# EAGLE design Orientation bracelet (EAGLE 7.7.0)
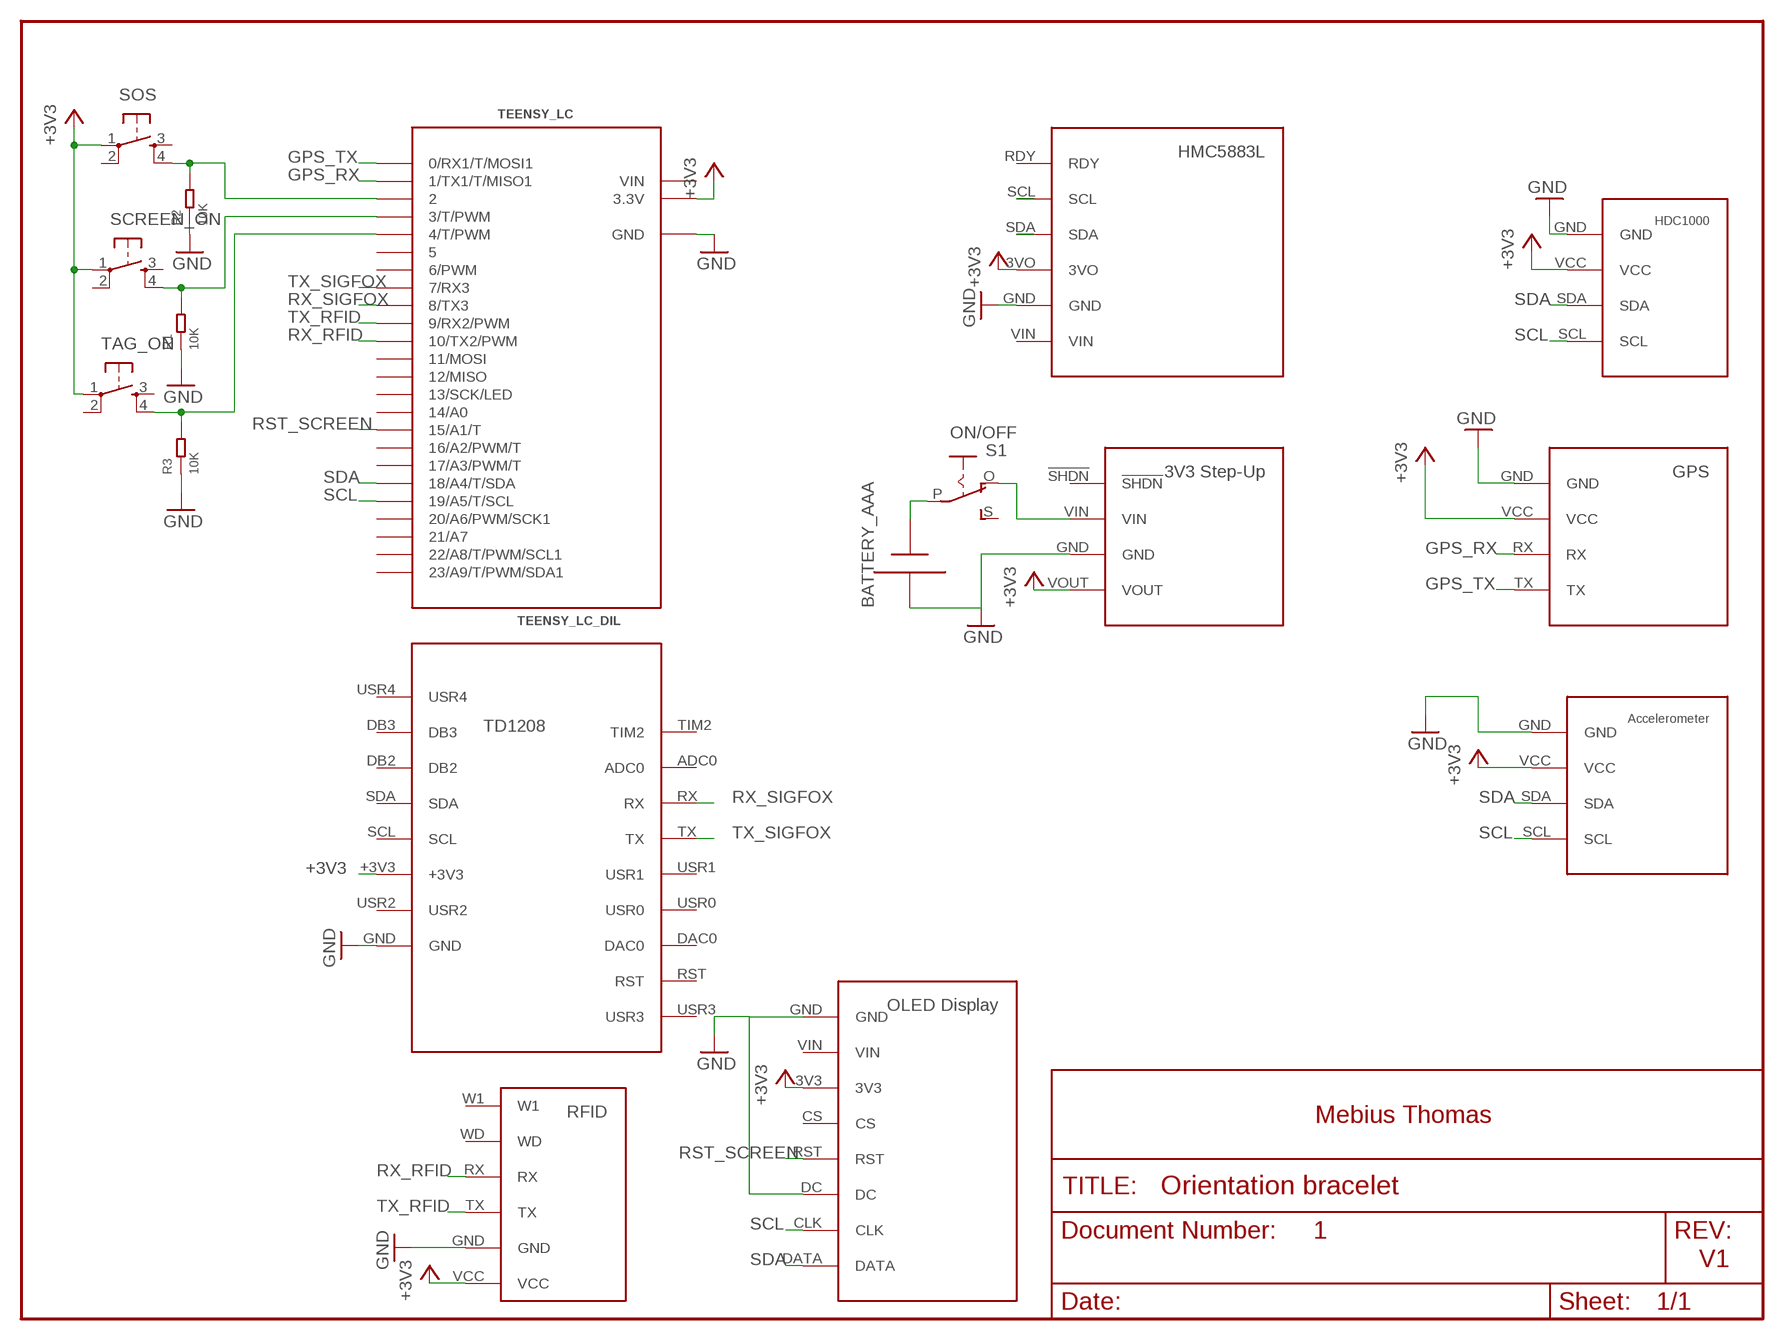
[diagram p0: schematic, sheet 1]

## Parts
BATTERY_AAA  AAA  [12BH412]
ON/OFF  S1  EG1218S  [EG1218]
R1  10K  DIP-RES-22K-5%-1/4W(PR-D2.3XL6.5MM)  [PR-D2.3XL6.5MM]
R2  10K  DIP-RES-22K-5%-1/4W(PR-D2.3XL6.5MM)  [PR-D2.3XL6.5MM]
R3  10K  DIP-RES-22K-5%-1/4W(PR-D2.3XL6.5MM)  [PR-D2.3XL6.5MM]
SCREEN_ON  TAC_SWITCHPTH  [TACTILE-PTH]
SOS  TAC_SWITCHPTH  [TACTILE-PTH]
TAG_ON  TAC_SWITCHPTH  [TACTILE-PTH]
TEENSY_LC  TEENSY_LC_DIL  [TEENSY_3.0-3.2&LC_DIL]
U$1  OLED_DISPLAY  [OLED_DISPLAY]
U$2  RFID"  [RFID]
U$3  3V3_STEP-UP  [3V3_STEP-UP]
U$4  ACCELEROMETER  [ACCELEROMETER]
U$5  HDC1000  [HDC1000]
U$6  GPS  [GPS]
U$7  HMC5883L  [HMC5883L]
U$8  TD1208  [TD1208]

## Nets
+3V3: SCREEN_ON.1 SOS.1 TAG_ON.1 TEENSY_LC.3.3V U$1.3V3 U$2.VCC U$3.VOUT U$4.VCC U$5.VCC U$6.VCC U$7.3VO U$8.+3V3
GND: BATTERY_AAA.- R1.1 R2.1 R3.1 TEENSY_LC.AGND(GND) TEENSY_LC.GND U$1.DC U$1.GND U$2.GND U$3.GND U$4.GND U$5.GND U$6.GND U$7.GND U$8.GND
GPS_RX: TEENSY_LC.1(1/TX1/T/MISO1) U$6.RX
GPS_TX: TEENSY_LC.0(0/RX1/T/MOSI1) U$6.TX
N$3: R2.2 SOS.4 TEENSY_LC.2
N$4: R1.2 SCREEN_ON.4 TEENSY_LC.3(3/T/PWM)
N$5: R3.2 TAG_ON.4 TEENSY_LC.4(4/T/PWM)
N$7: BATTERY_AAA.+ ON/OFF.P
N$8: ON/OFF.O U$3.VIN
RST_SCREEN: TEENSY_LC.15/A1(15/A1/T) U$1.RST
RX_RFID: TEENSY_LC.10(10/TX2/PWM) U$2.RX
RX_SIGFOX: TEENSY_LC.8(8/TX3) U$8.RX
SCL: TEENSY_LC.19/A5(19/A5/T/SCL) U$1.CLK U$4.SCL U$5.SCL U$7.SCL
SDA: TEENSY_LC.18/A4(18/A4/T/SDA) U$1.DATA U$4.SDA U$5.SDA U$7.SDA
TX_RFID: TEENSY_LC.9(9/RX2/PWM) U$2.TX
TX_SIGFOX: TEENSY_LC.7(7/RX3) U$8.TX
Unconnected: ON/OFF.S SCREEN_ON.2 SCREEN_ON.3 SOS.2 SOS.3 TAG_ON.2 TAG_ON.3 TEENSY_LC.5 TEENSY_LC.6(6/PWM) TEENSY_LC.11(11/MOSI) TEENSY_LC.12(12/MISO) TEENSY_LC.13(13/SCK/LED) TEENSY_LC.14/A0 TEENSY_LC.16/A2(16/A2/PWM/T) TEENSY_LC.17/A3(17/A3/PWM/T) TEENSY_LC.20/A6(20/A6/PWM/SCK1) TEENSY_LC.21/A7 TEENSY_LC.22/A8(22/A8/T/PWM/SCL1) TEENSY_LC.23/A9(23/A9/T/PWM/SDA1) U$1.CS U$1.VIN U$2.W1 U$2.WD U$3.!SHDN U$7.RDY U$7.VIN U$8.ADC0 U$8.DAC0 U$8.DB2 U$8.DB3 U$8.RST U$8.SCL U$8.SDA U$8.TIM2 U$8.USR0 U$8.USR1 U$8.USR2 U$8.USR3 U$8.USR4

## Notes on the sheet
- Mebius Thomas
- 1
- V1

## Power pins joined to a net without a drawn wire
VIN: TEENSY_LC.VIN

## Library data of the parts
BATTERY_AAA = adafruit:AAA: AAA PC pin holder Mouser part #12BH412 - but pretty much any 1x AAA battery holder should be the same http://www.ladyada.net/library/pcb/eaglelibrary.html
ON/OFF = adafruit:EG1218: SLIDING SWITCH 0.1" spacing through hole, vertical SPDT slide switch http://www.ladyada.net/library/pcb/eaglelibrary.html
R1-R3 = Seeed-OPL-Resistor:DIP-RES-22K-5%-1/4W(PR-D2.3XL6.5MM): 301020018; MPN: FHCFR-1/4W-223J; VALUE: 22K
SCREEN_ON SOS TAG_ON = JarduinoV5:TAC_SWITCH: Momentary Switch Button commonly used for reset or general input. Spark Fun Electronics SKU : COM-00097 SMT- SWCH-08247
TEENSY_LC = Teensy_3_and_LC_Series_Boards_v1.4:TEENSY_LC_DIL
U$1 = Mebius:OLED_DISPLAY: Ecran monochrome 128X64 ADA326
U$2 = Mebius:RFID: Module RFID 125 kHz
U$3 = Mebius:3V3_STEP-UP: Pololu 3.3V Step-Up Voltage Regulator U1V11F3
U$4 = Mebius:ACCELEROMETER: Accéléromètre 3 axes Grove
U$5 = Mebius:HDC1000: Grove Temperature&Humidity Sensor HDC1000
U$6 = Mebius:GPS: Module GPS Grove
U$7 = Mebius:HMC5883L: Triple-axis Magnetometer (Compass) Board - HMC5883L
U$8 = Mebius:TD1208

## Board
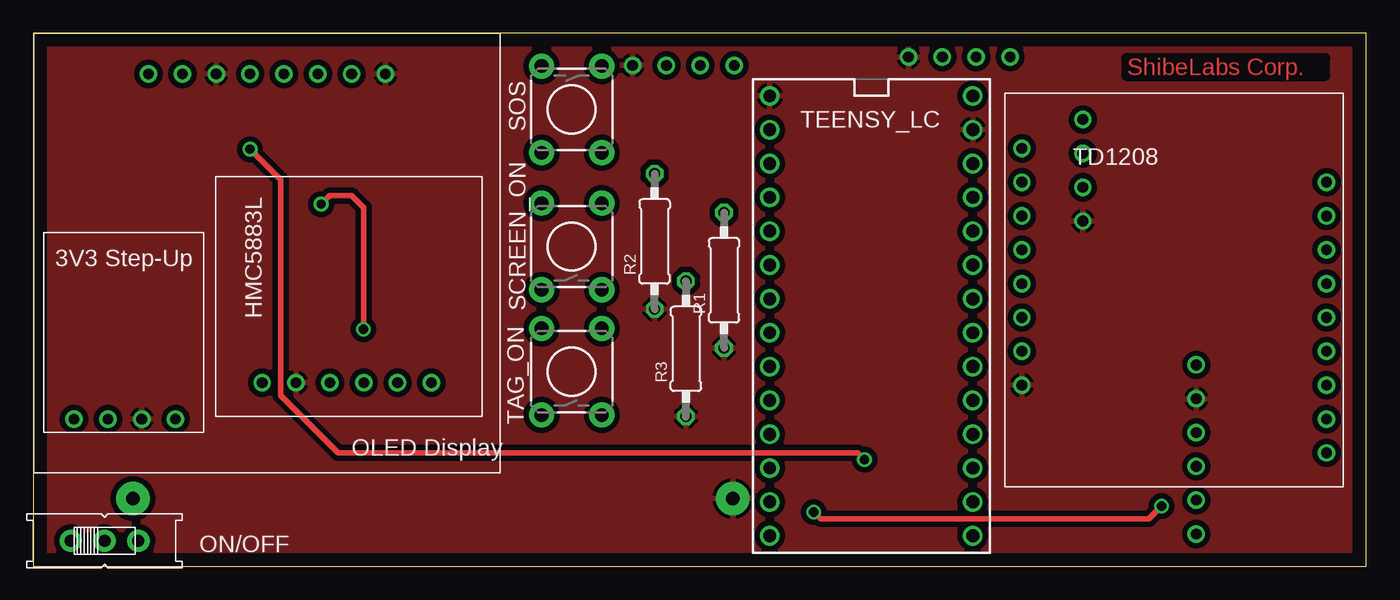
[diagram p1: board, top side]
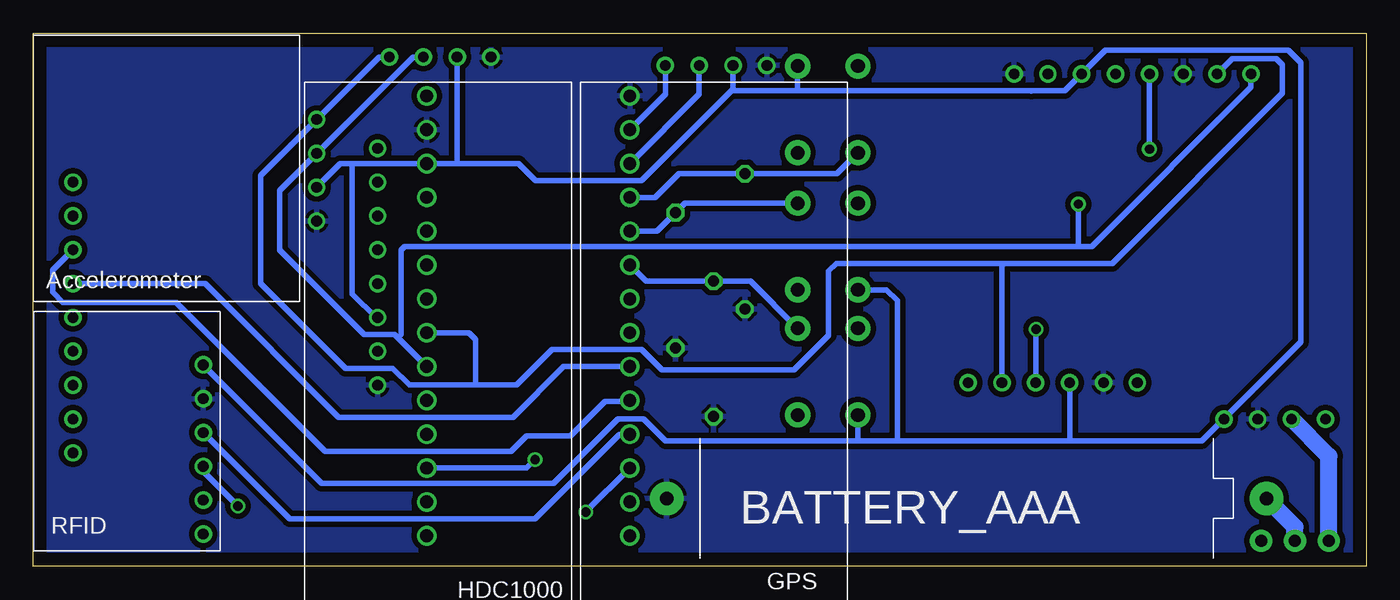
[diagram p2: board, bottom side, seen from below]

Size 100.01 x 40 mm. Coordinates in mm from the lower left corner, seen from the top.
Outline: 0.01,0 100.01,0 100,40 0,40 0.01,0
Copper layers (1*16): Top 0.035mm / dielectric 1.5mm / Bottom 0.035mm
Design rules "default *": minimum track width 10mil, minimum drill 24mil, track to track 16mil, track to pad 8mil, pad to pad 16mil, via to via 16mil, smd to smd 8mil, copper to edge 40mil, drill to drill 8mil, minimum pad ring 10mil, minimum via ring 8mil, stop-mask expansion 4mil, vias tented up to drill 0mil, thermal gap 10mil

### Footprints (pad centres in the part's own frame; a part is rotated, then mirrored left to right if it is on the bottom)
12BH412 = drill 1 pad 2.54: + 22.5,0; - -22.5,0
EG1218 = drill 0.9 pad 1.676: O -2.54,0; P 0,0; S 2.54,0
PR-D2.3XL6.5MM = drill 0.813 octagon: 1 -4.953,0; 2 5.207,0
TACTILE-PTH = drill 1.016 pad 1.88: 1 -3.251,2.261; 2 3.251,2.261; 3 -3.251,-2.261; 4 3.251,-2.261
TEENSY_3.0-3.2&LC_DIL = drill 0.965: 0 -7.62,13.97; 1 -7.62,11.43; 2 -7.62,8.89; 3 -7.62,6.35; 3.3V 7.62,11.43; 4 -7.62,3.81; 5 -7.62,1.27; 6 -7.62,-1.27; 7 -7.62,-3.81; 8 -7.62,-6.35; 9 -7.62,-8.89; 10 -7.62,-11.43; 11 -7.62,-13.97; 12 -7.62,-16.51; 13 7.62,-16.51; 14/A0 7.62,-13.97; 15/A1 7.62,-11.43; 16/A2 7.62,-8.89; 17/A3 7.62,-6.35; 18/A4 7.62,-3.81; 19/A5 7.62,-1.27; 20/A6 7.62,1.27; 21/A7 7.62,3.81; 22/A8 7.62,6.35; 23/A9 7.62,8.89; AGND 7.62,13.97; GND -7.62,16.51; VIN 7.62,16.51
OLED_DISPLAY = drill 0.8: 3V3 3.81,13.462; CLK -6.35,13.462; CS 1.27,13.462; DATA -8.89,13.462; DC -3.81,13.462; GND 8.89,13.462; RST -1.27,13.462; VIN 6.35,13.462
RFID = drill 0.8: GND -2.54,6.35; RX 2.54,6.35; TX 0,6.35; VCC -5.08,6.35; W1 7.62,6.35; WD 5.08,6.35
3V3_STEP-UP = drill 0.8: !SHDN 3.81,6.35; GND -1.27,6.35; VIN 1.27,6.35; VOUT -3.81,6.35
ACCELEROMETER = drill 0.8: GND 3.81,11.43; SCL -3.81,11.43; SDA -1.27,11.43; VCC 1.27,11.43
HDC1000 = drill 0.8: GND 5.08,21.59; SCL -2.54,21.59; SDA 0,21.59; VCC 2.54,21.59
GPS = drill 0.8: GND 6.35,12.7; RX 1.27,12.7; TX -1.27,12.7; VCC 3.81,12.7
HMC5883L = drill 0.8: 3VO 1.27,6.35; GND 3.81,6.35; RDY -6.35,6.35; SCL -3.81,6.35; SDA -1.27,6.35; VIN 6.35,6.35
TD1208 = drill 0.8: +3V3 -11.43,-1.27; ADC0 11.43,6.35; DAC0 11.43,-6.35; DB2 -11.43,6.35; DB3 -11.43,8.89; GND -11.43,-6.35; RST 11.43,-8.89; RX 11.43,3.81; SCL -11.43,1.27; SDA -11.43,3.81; TIM2 11.43,8.89; TX 11.43,1.27; USR0 11.43,-3.81; USR1 11.43,-1.27; USR2 -11.43,-3.81; USR3 11.43,-11.43; USR4 -11.43,11.43

### Placement (x,y rotation side)
BATTERY_AAA  29.98,5.08 0 bottom
ON/OFF  5.34,1.91 0 top
R1  51.82,21.34 90 top
R2  46.62,24.26 90 top
R3  48.97,16.19 90 top
SCREEN_ON  40.39,24 90 top
SOS  40.39,34.29 270 top
TAG_ON  40.39,14.61 90 top
TEENSY_LC  62.87,18.8 0 top
U$1  17.53,23.5 0 top
U$2  93.61,10.03 270 bottom
U$3  6.87,17.4 180 top
U$4  90.18,29.72 270 bottom
U$5  70.75,16.64 0 bottom
U$6  51.32,24.89 0 bottom
U$7  23.52,20.13 180 top
U$8  85.61,19.94 0 top

### Tracks (layer width: path | path; a pad name or v marks a point on that pad's centre or on a via)
+3V3
  Bottom 0.406: U$2.VCC 78.37,6.22 60.97,6.22 56.14,11.05 54.24,11.05 52.59,9.4 38.23,9.4 | 76.08,30.23 TEENSY_LC.3.3V 68.33,30.23 | 76.08,30.23 76.97,30.23 U$4.VCC | 47.63,35.69 54.36,28.96 62.34,28.96 63.61,30.23 68.33,30.23 | U$6.VCC 47.51,35.81 47.63,35.69 | 47.63,35.69 42.55,35.69 | 42.55,35.69 25.15,35.69 | 25.15,35.69 22.61,35.69 U$1.3V3 19.57,38.73 5.85,38.73 4.9,37.78 4.9,16.83 U$3.VOUT 12.33,9.4 22.17,9.4 | SOS.1 42.65,35.79 42.55,35.69 | 25.13,35.67 25.15,35.69 | U$5.VCC 68.21,30.35 68.33,30.23 | SCREEN_ON.1 36,20.75 35.19,19.94 35.19,9.4 | U$8.+3V3 74.3,18.67 76.08,20.45 76.08,30.23 | 38.23,9.4 35.19,9.4 | 35.19,9.4 22.17,9.4 | TAG_ON.1 38.13,9.5 38.23,9.4 | U$7.3VO 22.25,9.48 22.17,9.4
GND
  pour Top: -3.8,48.26 110.5,48.26 110.5,-7.62 -3.8,-7.62
  pour Bottom: -5.07,50.8 113.04,50.8 113.04,-10.16 -6.34,-10.16 -6.34,50.8
GPS_RX
  Bottom 0.406: U$6.RX 50.05,35.43 TEENSY_LC.1
GPS_TX
  Bottom 0.406: U$6.TX 52.59,35.43 TEENSY_LC.0
N$3
  Bottom 0.406: SOS.4 39.71,29.46 R2.2 51.57,29.46 53.35,27.69 TEENSY_LC.2
N$4
  Bottom 0.406: SCREEN_ON.4 51.11,27.25 R1.2 53.22,25.15 TEENSY_LC.3
N$5
  Bottom 0.406: TAG_ON.4 46.2,21.4 R3.2 54.05,21.4 TEENSY_LC.4
N$7
  Bottom 1.27: ON/OFF.P 5.34,2.94 BATTERY_AAA.+
N$8
  Bottom 1.27: ON/OFF.O 2.8,8.26 U$3.VIN
RST_SCREEN  (via drill 0.7)
  Top 0.406: v62.36,8 61.86,8.51 22.87,8.51 18.55,12.83 18.55,29.02 v16.26,31.3
  Bottom 0.406: v62.36,8 63,7.37 TEENSY_LC.15/A1 | U$1.RST v16.26,31.3
RX_RFID  (via drill 0.7)
  Top 0.406: v84.65,4.51 83.7,3.56 59.06,3.56 v58.55,4.06
  Bottom 0.406: TEENSY_LC.10 v58.55,4.06 | U$2.RX 87.26,7.11 v84.65,4.51
RX_SIGFOX
  Bottom 0.406: U$8.RX 98.56,22.23 98.56,20.57 97.8,19.81 89.29,19.81 78.11,8.64 64.14,8.64 63,9.78 59.7,9.78 57.09,12.38 55.32,12.38 TEENSY_LC.8
SCL
  Bottom 0.406: 27.19,22.73 19.06,22.73 6.29,35.5 6.29,37.66 6.74,38.1 10.04,38.1 U$1.CLK | 27.19,22.73 39.76,22.73 40.33,22.16 40.33,17.34 42.93,14.73 52.84,14.73 54.36,16.26 61.09,16.26 63.76,13.59 66.68,13.59 | 66.68,13.59 71.76,13.59 73.03,14.86 76.59,14.86 82.94,21.21 82.94,29.34 U$4.SCL 74.05,38.23 U$5.SCL | TEENSY_LC.19/A5 67.32,17.53 66.81,17.02 66.81,13.72 66.68,13.59 | U$7.SCL 27.33,22.59 27.19,22.73
SDA  (via drill 0.7)
  Top 0.406: v24.77,17.78 24.77,26.92 23.88,27.81 22.23,27.81 v21.6,27.18
  Bottom 0.406: U$5.SDA 71.51,38.23 U$4.SDA 81.54,28.19 81.54,23.75 75.19,17.4 72.91,17.4 72.65,17.14 | 72.65,17.14 TEENSY_LC.18/A4 | U$1.DATA 8.64,35.94 20.58,24 21.47,24 | 21.47,24 72.14,24 72.4,23.75 72.4,17.4 72.65,17.14 | U$7.SDA 24.79,17.76 v24.77,17.78 | v21.6,27.18 21.6,24.13 21.47,24
TX_RFID
  Bottom 0.406: TEENSY_LC.9 56.01,9.91 62.36,3.56 80.78,3.56 U$2.TX
TX_SIGFOX
  Bottom 0.406: TEENSY_LC.7 60.21,14.99 64.02,11.18 77.1,11.18 87.13,21.21 U$8.TX

### Text on the board
Top: ShibeLabs Corp.